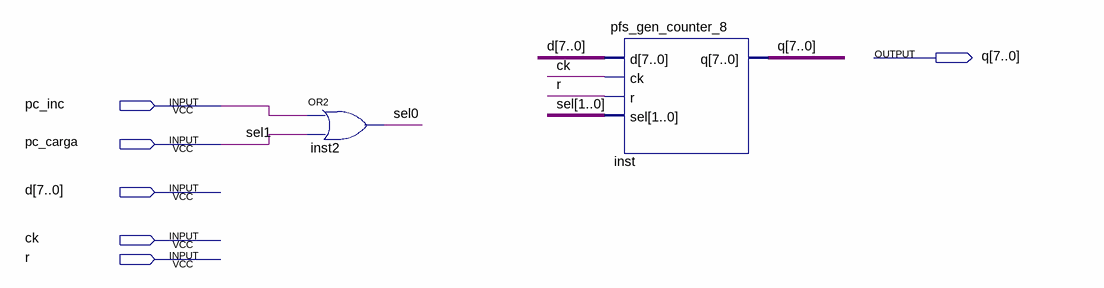
[diagram p0: schematic sheet]
// Quartus schematic pfs_neander_pc.bdf as structural Verilog: 2 symbols, 6 pins
module pfs_neander_pc (
  input  pc_inc,
  input  pc_carga,
  input  [7:0] d,
  input  ck,
  input  r,
  output [7:0] q
);

  wire [0:0] sel;

  or inst2 (sel[0], pc_inc, pc_carga);
  pfs_gen_counter_8 inst (.d(d), .ck(ck), .r(r), .sel({pc_carga, sel[0]}), .q(q));

  // Other names for the same wires on the sheet: sel[1] = pc_carga; sel1 = pc_carga
endmodule
